# EAGLE schematic ethernet-dlt (EAGLE 9.4.2)
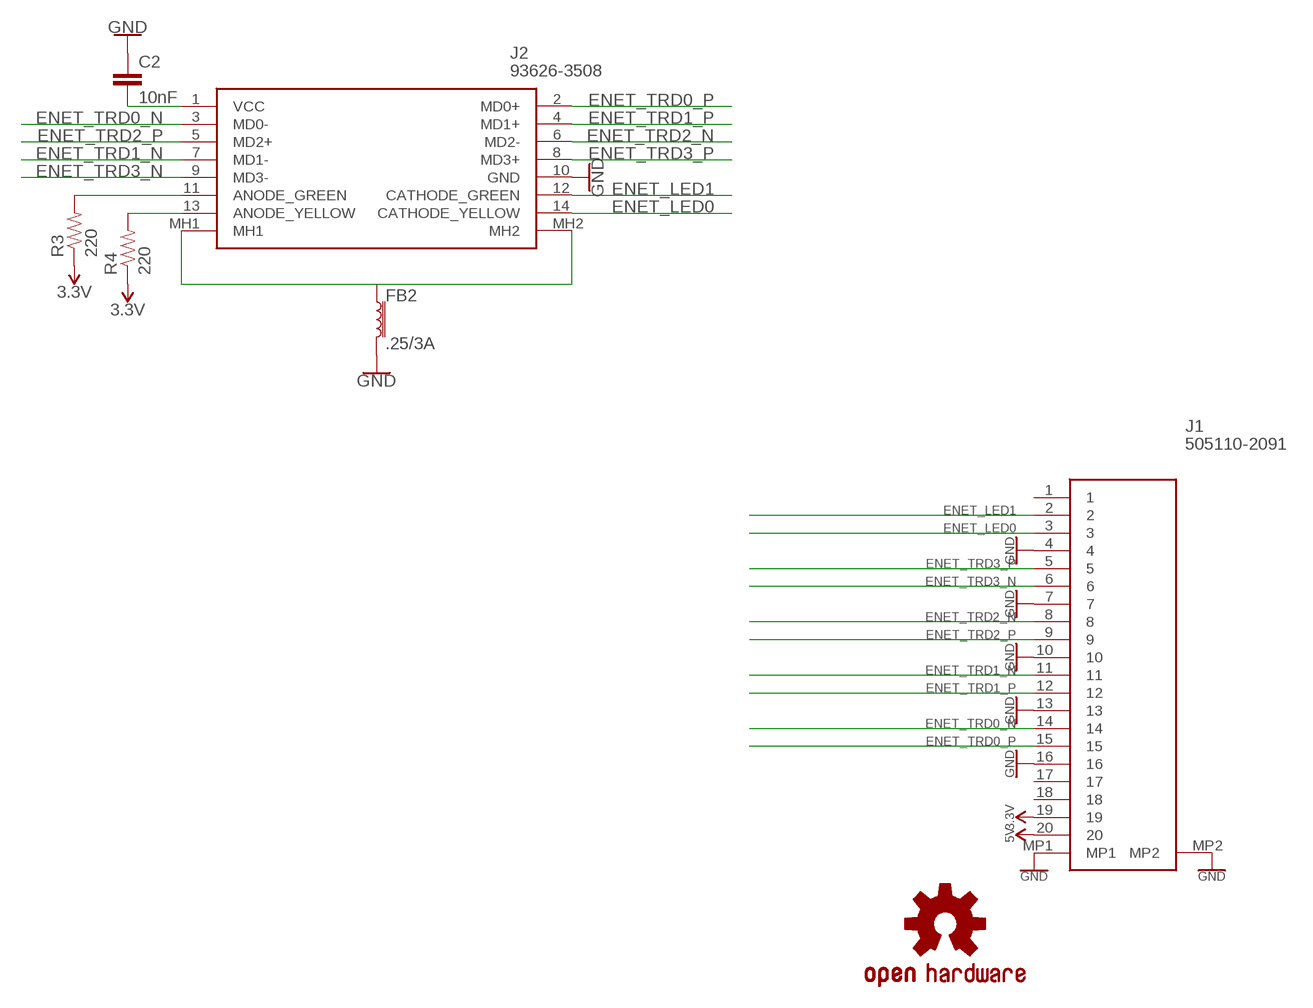
[diagram p0: schematic, sheet 1]

## Parts
C2  10nF  10NF-0603-50V-10%  [0603]
FB2  .25/3A  FERRITE_BEAD-0603  [0603]
J1  505110-2091  [5051102091]
J2  93626-3508  [936263508]
LOGO1  OSHW-LOGOS-COPPER  [OSHW-LOGO-S_COPPER]
R3  220  RESISTOR0805-RES  [0805]
R4  220  RESISTOR0805-RES  [0805]

## Nets
3.3V: J1.19 R3.1 R4.1
5V: J1.20
ENET_LED0: J1.3 J2.14(CATHODE_YELLOW)
ENET_LED1: J1.2 J2.12(CATHODE_GREEN)
ENET_TRD0_N: J1.14 J2.3(MD0-)
ENET_TRD0_P: J1.15 J2.2(MD0+)
ENET_TRD1_N: J1.11 J2.7(MD1-)
ENET_TRD1_P: J1.12 J2.4(MD1+)
ENET_TRD2_N: J1.8 J2.6(MD2-)
ENET_TRD2_P: J1.9 J2.5(MD2+)
ENET_TRD3_N: J1.6 J2.9(MD3-)
ENET_TRD3_P: J1.5 J2.8(MD3+)
GND: C2.1 FB2.2 J1.4 J1.7 J1.10 J1.13 J1.16 J1.MP1 J1.MP2 J2.10(GND)
N$5: J2.11(ANODE_GREEN) R3.2
N$6: J2.13(ANODE_YELLOW) R4.2
N$7: C2.2 J2.1(VCC)
N$8: FB2.1 J2.MH1 J2.MH2
Unconnected: J1.1 J1.17 J1.18

## Library data of the parts
C2 = SparkFun-Capacitors:10NF: 0.01uF/10nF/10,000pF ceramic capacitors A capacitor is a passive two-terminal electrical component used to store electrical energy temporarily in an electric field. CAP-09321; PROD_ID: CAP-00867
FB2 = SparkFun-Coils:FERRITE_BEAD: Ferrite Bead (blocks, cores, rings, chokes, etc.) Inductor with layers of ferrite used to suppress high frequencies. Often used to isolate high frequency noise. SparkFun Products: IOIO-OTG - V2.2 <https://www.sparkfun.com/products/13613> SparkFun SAMD21 Mini Breakout <https://www.sparkfun.com/products/13664> SparkFun 6 Degrees of Freedom Breakout - LSM6DS3 <https://www.sparkfun.com/products/13339> SparkFun SAMD21 Dev Breakout <https://www.sparkfun.com/products/13672>; PROD_ID: NDUC-13805; VALUE: 30Ω/1.8A
J1 = SamacSys_Parts:505110-2091: MOLEX - 505110-2091 - CONNECTOR, FFC/FPC, 20POS, 1ROW, 0.5MM Source: Datasheet <https://componentsearchengine.com/Datasheets/1/505110-2091.pdf>; DESCRIPTION: MOLEX - 505110-2091 - CONNECTOR, FFC/FPC, 20POS, 1ROW, 0.5MM; HEIGHT: 2.1mm; MANUFACTURER_NAME: Molex; MANUFACTURER_PART_NUMBER: 505110-2091; MOUSER_PART_NUMBER: 538-505110-2091; MOUSER_PRICE-STOCK: https://www.mouser.com/Search/Refine.aspx?Keyword=538-505110-2091
J2 = SamacSys_Parts:93626-3508: MOLEX - 93626-3508 - RJ45 CONNECTOR, JACK, 8P8C, 1PORT, TH Source: Datasheet <https://componentsearchengine.com/Datasheets/1/93626-3508.pdf>; DESCRIPTION: MOLEX - 93626-3508 - RJ45 CONNECTOR, JACK, 8P8C, 1PORT, TH; HEIGHT: 15.4mm; MANUFACTURER_NAME: Molex; MANUFACTURER_PART_NUMBER: 93626-3508; MOUSER_PART_NUMBER: 538-93626-3508; MOUSER_PRICE-STOCK: https://www.mouser.com/Search/Refine.aspx?Keyword=538-93626-3508
LOGO1 = SparkFun-Aesthetics:OSHW-LOGO: Open-Source Hardware (OSHW) Logo This logo indicates the piece of hardware it is found on incorporates a OSHW license and/or adheres to the definition of open source hardware found here: http://freedomdefined.org/OSHW
R3 R4 = SparkFun-Passives:RESISTOR: Resistor Basic schematic elements and footprints for 0603, 1206, and PTH resistors.